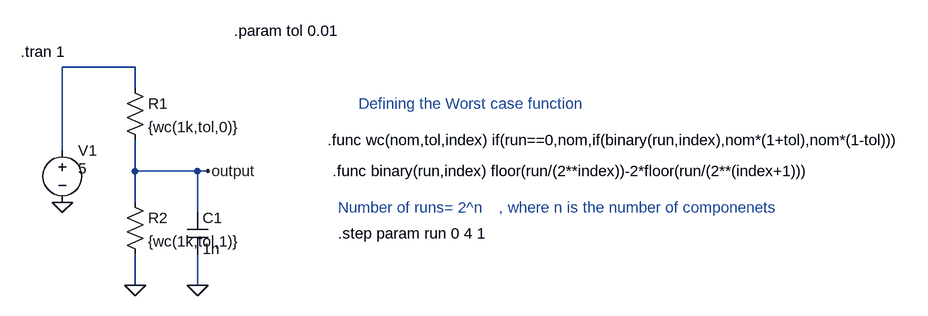
[diagram p0: schematic Montecarlo_2.asc]
Montecarlo_2.asc, the LTspice schematic file:
Version 4.1
SHEET 1 1540 680
WIRE 224 -112 112 -112
WIRE 224 -80 224 -112
WIRE 112 16 112 -112
WIRE 224 48 224 0
WIRE 320 48 224 48
WIRE 336 48 320 48
WIRE 224 96 224 48
WIRE 320 112 320 48
WIRE 224 224 224 176
WIRE 320 224 320 176
FLAG 112 96 0
FLAG 224 224 0
FLAG 336 48 output
FLAG 320 224 0
SYMBOL res 208 -96 R0
SYMATTR InstName R1
SYMATTR Value {wc(1k,tol,0)}
SYMBOL res 208 80 R0
SYMATTR InstName R2
SYMATTR Value {wc(1k,tol,1)}
SYMBOL voltage 112 0 R0
WINDOW 123 24 124 Left 2
WINDOW 39 0 0 Left 0
WINDOW 3 24 44 Left 2
SYMATTR InstName V1
SYMATTR Value 5
SYMBOL cap 304 112 R0
SYMATTR InstName C1
SYMATTR Value 1n
TEXT 376 -168 Left 2 !.param tol 0.01
TEXT 568 -56 Left 2 ;Defining the Worst case function
TEXT 520 0 Left 2 !.func wc(nom,tol,index) if(run==0,nom,if(binary(run,index),nom*(1+tol),nom*(1-tol)))
TEXT 528 48 Left 2 !.func binary(run,index) floor(run/(2**index))-2*floor(run/(2**(index+1)))
TEXT 536 104 Left 2 ;Number of runs= 2^n
TEXT 784 104 Left 2 ;, where n is the number of componenets
TEXT 536 144 Left 2 !.step param run 0 4 1
TEXT 48 -136 Left 2 !.tran 1

The netlist it stands for:
* Montecarlo_2.asc
R1 N001 output {wc(1k,tol,0)}
R2 output 0 {wc(1k,tol,1)}
V1 N001 0 5
C1 output 0 1n
.param tol 0.01
* Defining the Worst case function
.func wc(nom,tol,index) if(run==0,nom,if(binary(run,index),nom*(1+tol),nom*(1-tol)))
.func binary(run,index) floor(run/(2**index))-2*floor(run/(2**(index+1)))
* Number of runs= 2^n
* , where n is the number of componenets
.step param run 0 4 1
.tran 1
.backanno
.end